# EAGLE design LaunchPadFlightController_Schematic (EAGLE 7.2.0)
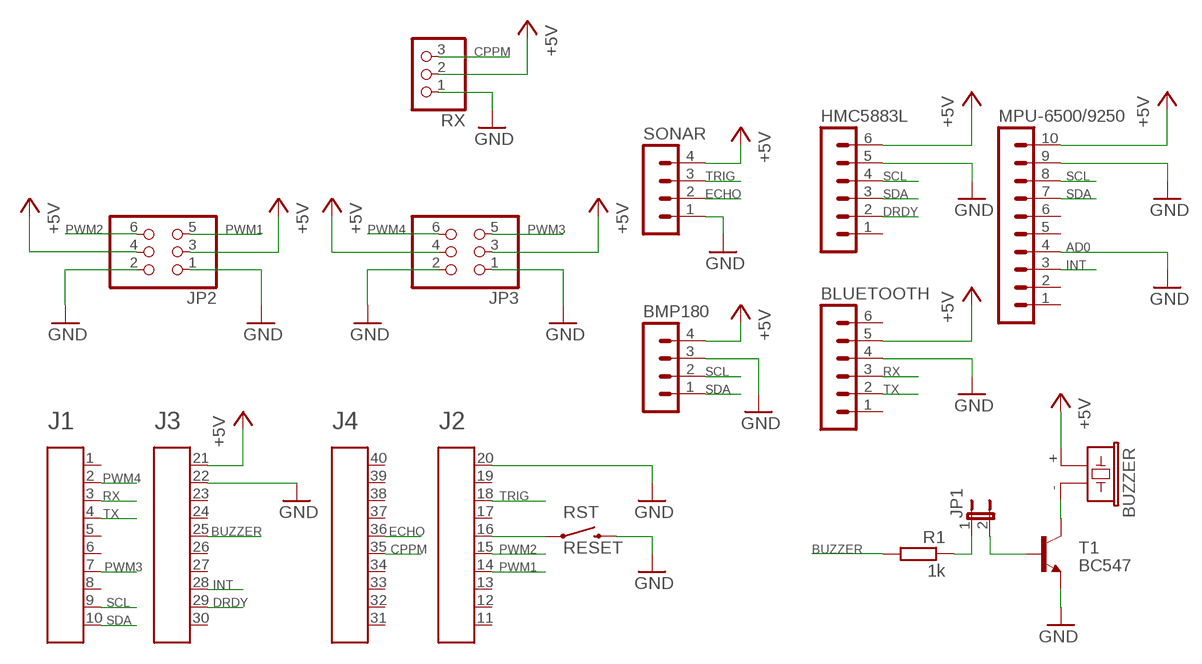
[diagram p0: schematic, sheet 1]

## Parts
A1  HEADER4X10-BOOSTERPACK  [4X10-BOOSTERPACK]
BLUETOOTH  MA06-1  [MA06-1]
BMP180  MA04-1  [MA04-1]
BUZZER  F/CM12P  [F/CM12P]
HMC5883L  MA06-1  [MA06-1]
JP1  JP1E  [JP1]
JP2  PINHD-2X3  [2X03]
JP3  PINHD-2X3  [2X03]
MPU-6500/9250  MA10-1  [MA10-1]
R1  1k  R-EU_0207/10  [0207/10]
RST  RESET  SWITCHES_PTH_EZ  [TACTILE-PTH-EZ]
RX  PINHD-1X3  [1X03]
SONAR  MA04-1  [MA04-1]
T1  BC547  [TO92]

## Nets
+5V: A1.21 BLUETOOTH.5 BMP180.4 BUZZER.+ HMC5883L.6 JP2.3 JP2.4 JP3.3 JP3.4 MPU-6500/9250.10 RX.2 SONAR.4
BUZZER: A1.25 R1.2
CPPM: A1.35 RX.3
DRDY: A1.29 HMC5883L.2
ECHO: A1.36 SONAR.2
GND: A1.20 A1.22 BLUETOOTH.4 BMP180.3 HMC5883L.5 JP2.1 JP2.2 JP3.1 JP3.2 MPU-6500/9250.4 MPU-6500/9250.9 RST.3 RX.1 SONAR.1 T1.1(E)
INT: A1.28 MPU-6500/9250.3
N$1: A1.16 RST.1
N$2: JP1.1 R1.1
N$3: JP1.2 T1.2(B)
N$4: BUZZER.- T1.3(C)
PWM1: A1.14 JP2.5
PWM2: A1.15 JP2.6
PWM3: A1.7 JP3.5
PWM4: A1.2 JP3.6
RX: A1.3 BLUETOOTH.3
SCL: A1.9 BMP180.2 HMC5883L.4 MPU-6500/9250.8
SDA: A1.10 BMP180.1 HMC5883L.3 MPU-6500/9250.7
TRIG: A1.18 SONAR.3
TX: A1.4 BLUETOOTH.2
Unconnected: A1.1 A1.5 A1.6 A1.8 A1.11 A1.12 A1.13 A1.17 A1.19 A1.23 A1.24 A1.26 A1.27 A1.30 A1.31 A1.32 A1.33 A1.34 A1.37 A1.38 A1.39 A1.40 BLUETOOTH.1 BLUETOOTH.6 HMC5883L.1 MPU-6500/9250.1 MPU-6500/9250.2 MPU-6500/9250.5 MPU-6500/9250.6

## Notes on the sheet
- AD0

## Library data of the parts
A1 = EAGLE_BoosterPack_Library:HEADER4X10-BOOSTERPACK
BLUETOOTH HMC5883L = con-lstb:MA06-1: PIN HEADER; OC_FARNELL: unknown; OC_NEWARK: unknown
BMP180 SONAR = con-lstb:MA04-1: PIN HEADER; OC_FARNELL: unknown; OC_NEWARK: unknown
BUZZER = buzzer:F/CM12P: BUZZER Source: Buerklin; OC_FARNELL: unknown; OC_NEWARK: unknown
JP1 = jumper:JP1E: JUMPER
JP2 JP3 = pinhead:PINHD-2X3: PIN HEADER
MPU-6500/9250 = con-lstb:MA10-1: PIN HEADER; OC_FARNELL: unknown; OC_NEWARK: unknown
R1 = rcl:R-EU_: RESISTOR, European symbol
RST = EAGLE_BoosterPack_Library:SWITCHES_: Various NO switches- pushbuttons, reed, etc
RX = pinhead:PINHD-1X3: PIN HEADER
T1 = transistor:BC547: NPN TRANSISTOR

## Board
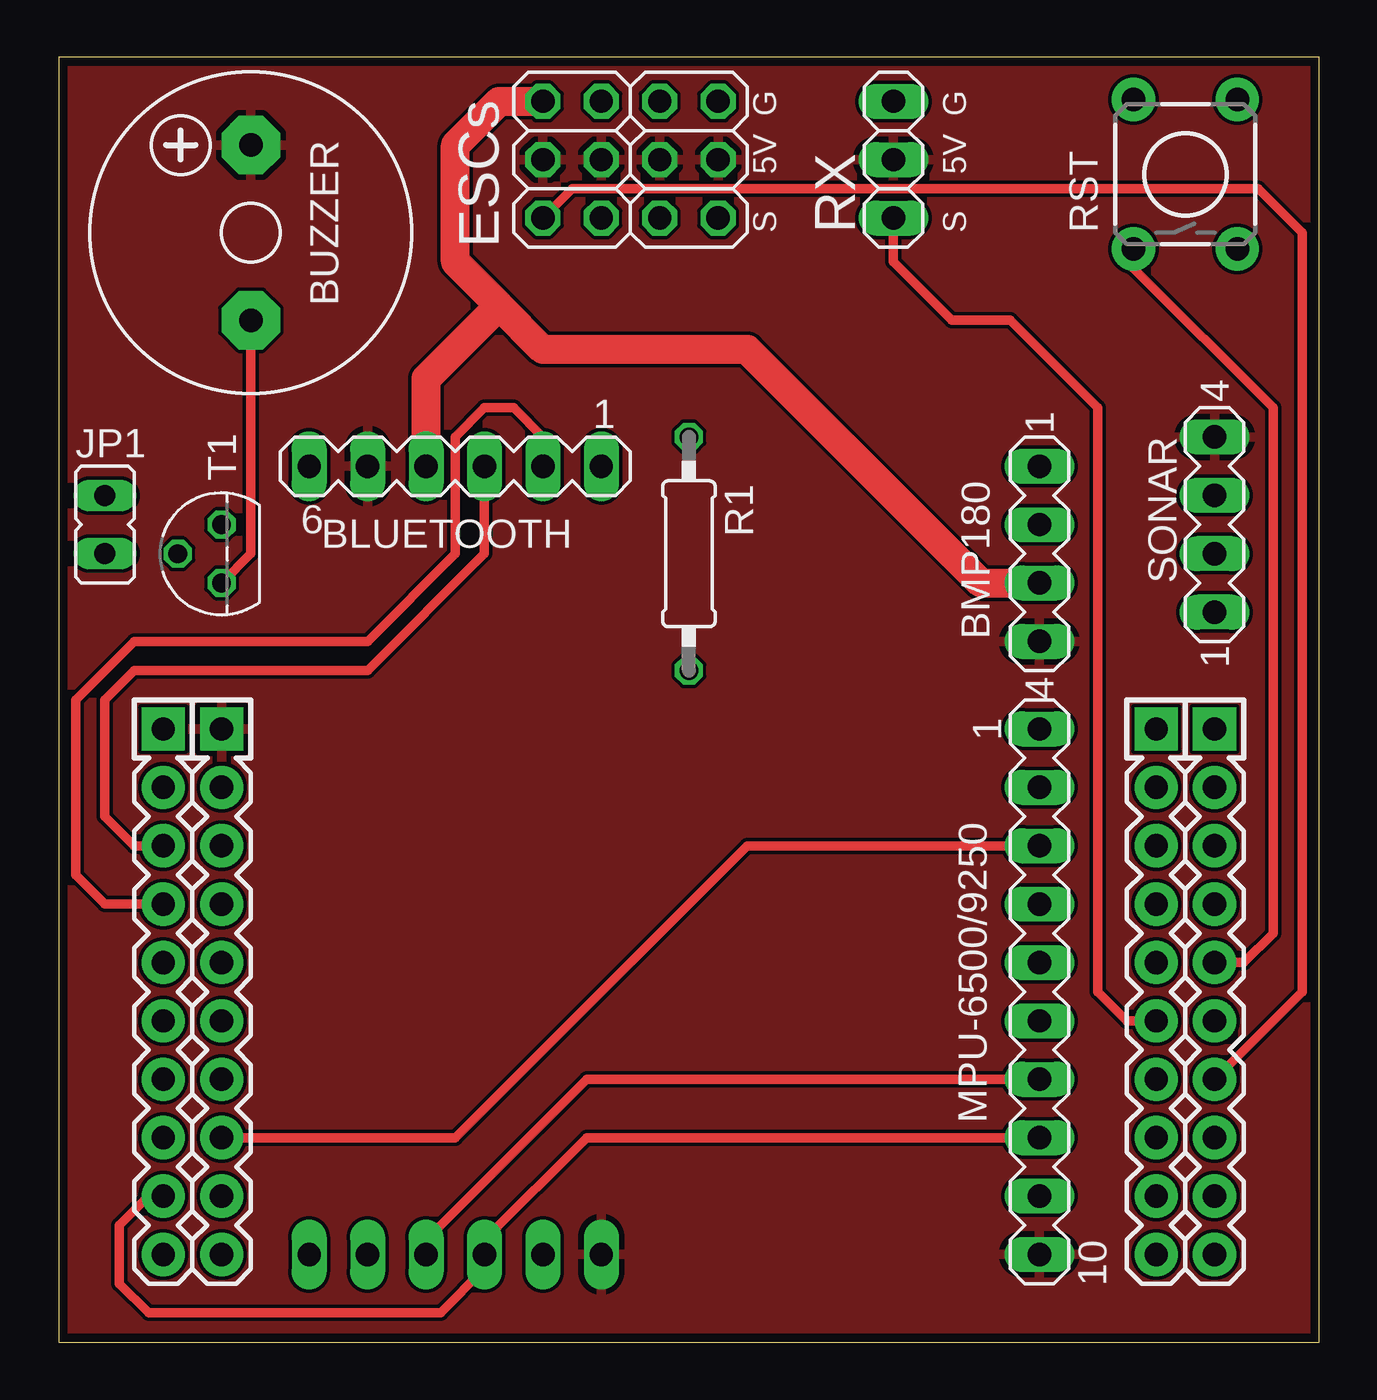
[diagram p1: board, top side]
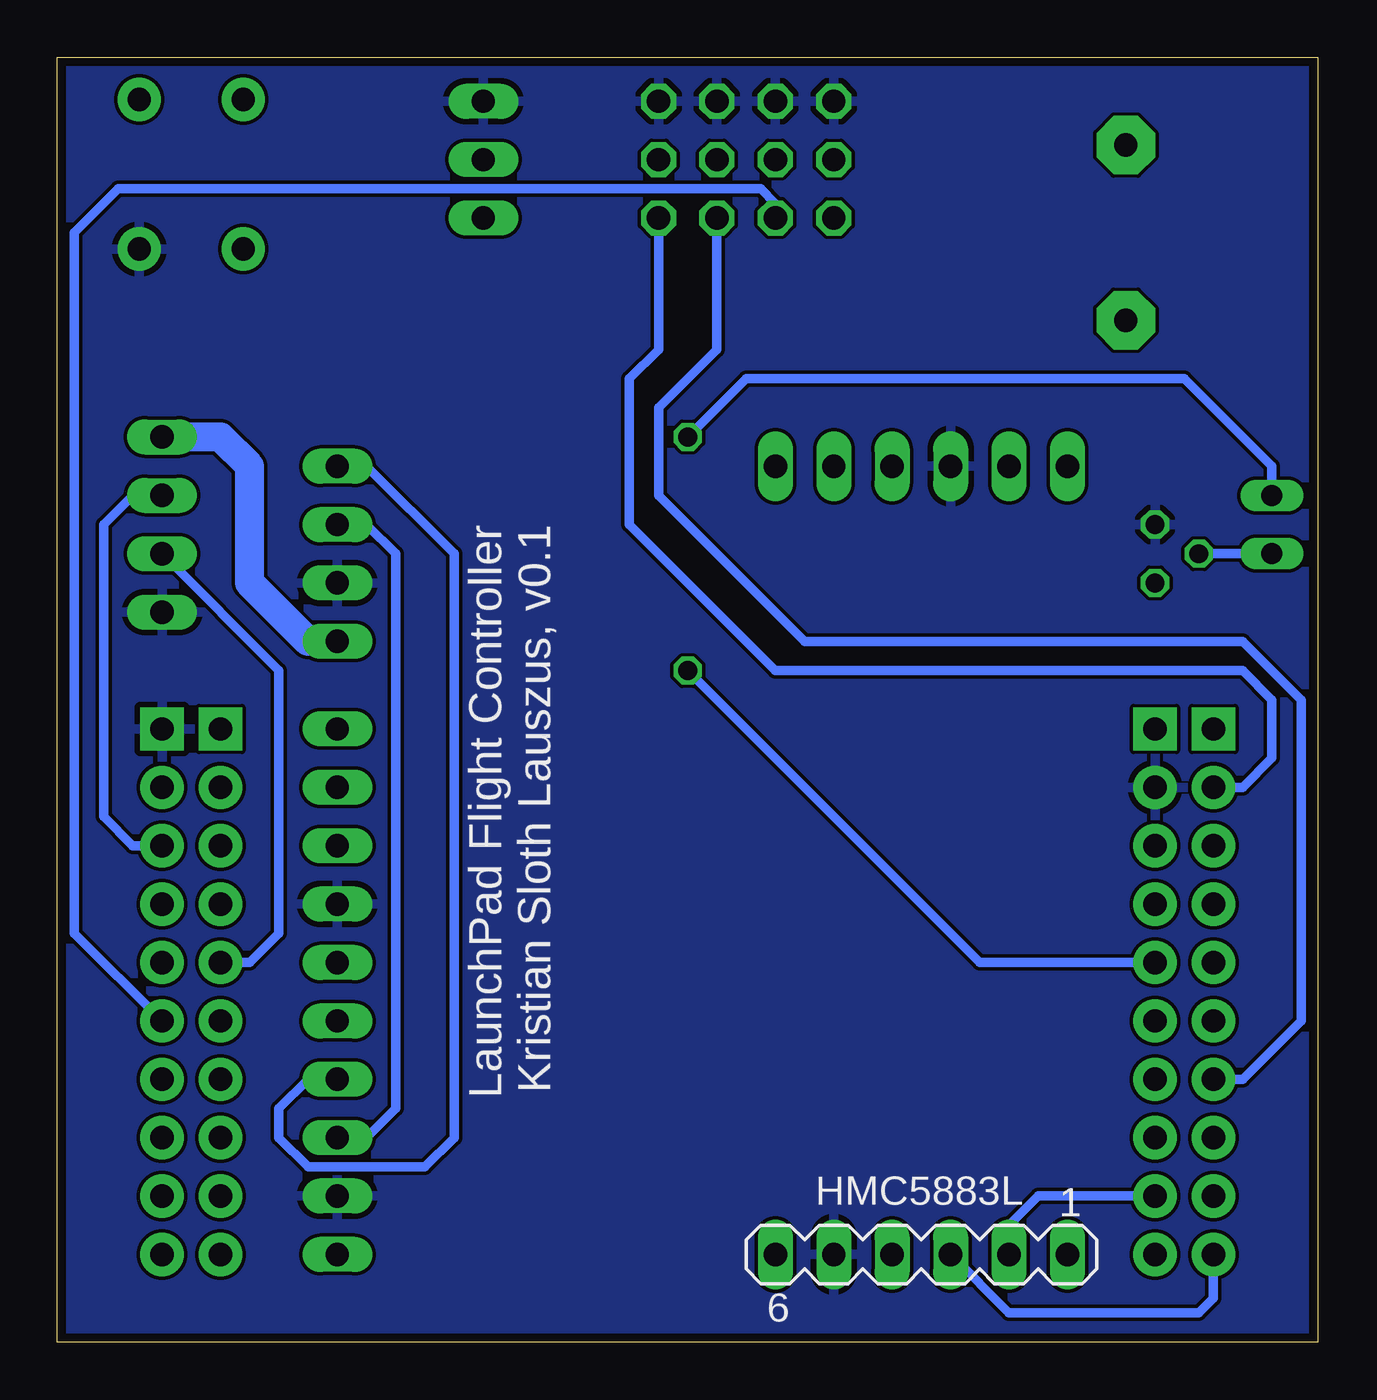
[diagram p2: board, bottom side, seen from below]

Size 54.81 x 55.88 mm. Coordinates in mm from the lower left corner, seen from the top.
Outline: 0,0 54.81,0 54.81,55.88 0,55.88 0,0
Copper layers (1*16): Top 0.0356mm / dielectric 1.5011mm / Bottom 0.0356mm
Design rules "LaenPCBOrder": minimum track width 6mil, minimum drill 13mil, track to track 6mil, track to pad 6mil, pad to pad 6mil, via to via 6mil, smd to smd 6mil, copper to edge 15mil, drill to drill 6mil, minimum pad ring 7mil, minimum via ring 7mil, stop-mask expansion 3mil, vias tented up to drill 0mil, thermal gap 10mil

### Footprints (pad centres in the part's own frame; a part is rotated, then mirrored left to right if it is on the bottom)
4X10-BOOSTERPACK = drill 1.016 pad 1.88 square: 1 0,10.16; 20 45.72,10.16; 21 2.54,10.16; 40 43.18,10.16 | drill 1.016 pad 1.88: 2 0,7.62; 3 0,5.08; 4 0,2.54; 5 0,0; 6 0,-2.54; 7 0,-5.08; 8 0,-7.62; 9 0,-10.16; 10 0,-12.7; 11 45.72,-12.7; 12 45.72,-10.16; 13 45.72,-7.62; 14 45.72,-5.08; 15 45.72,-2.54; 16 45.72,0; 17 45.72,2.54; 18 45.72,5.08; 19 45.72,7.62; 22 2.54,7.62; 23 2.54,5.08; 24 2.54,2.54; 25 2.54,0; 26 2.54,-2.54; 27 2.54,-5.08; 28 2.54,-7.62; 29 2.54,-10.16; 30 2.54,-12.7; 31 43.18,-12.7; 32 43.18,-10.16; 33 43.18,-7.62; 34 43.18,-5.08; 35 43.18,-2.54; 36 43.18,0; 37 43.18,2.54; 38 43.18,5.08; 39 43.18,7.62
MA06-1 = drill 1.016 long: 1 -6.35,0; 2 -3.81,0; 3 -1.27,0; 4 1.27,0; 5 3.81,0; 6 6.35,0
MA04-1 = drill 1.016 long: 1 -3.81,0; 2 -1.27,0; 3 1.27,0; 4 3.81,0
F/CM12P = drill 1.016 pad 2.54 octagon: + 3.81,0; - -3.81,0
JP1 = drill 0.914 long: 1 0,-1.27; 2 0,1.27
2X03 = drill 1.016 octagon: 1 -2.54,-1.27; 2 -2.54,1.27; 3 0,-1.27; 4 0,1.27; 5 2.54,-1.27; 6 2.54,1.27
MA10-1 = drill 1.016 long: 1 -11.43,0; 2 -8.89,0; 3 -6.35,0; 4 -3.81,0; 5 -1.27,0; 6 1.27,0; 7 3.81,0; 8 6.35,0; 9 8.89,0; 10 11.43,0
0207/10 = drill 0.813 octagon: 1 -5.08,0; 2 5.08,0
TACTILE-PTH-EZ = drill 1.016 pad 1.88: 1 -3.251,2.261; 2 3.251,2.261; 3 -3.251,-2.261; 4 3.251,-2.261
1X03 = drill 1.016 long: 1 -2.54,0; 2 0,0; 3 2.54,0
TO92 = drill 0.813 octagon: 1 1.27,0; 2 0,1.905; 3 -1.27,0

### Placement (x,y rotation side)
A1  4.55,16.51 0 top
BLUETOOTH  17.25,38.1 180 top
BMP180  42.65,34.29 270 top
BUZZER  8.36,48.26 90 top
HMC5883L  17.25,3.81 180 bottom
JP1  2.01,35.56 180 top
JP2  22.33,51.44 270 top
JP3  27.41,51.44 270 top
MPU-6500/9250  42.65,15.24 270 top
R1  27.41,34.29 270 top
RST  49,50.8 90 top
RX  36.3,51.44 270 top
SONAR  50.27,35.56 90 top
T1  7.09,34.29 90 top

### Tracks (layer width: path | path; a pad name or v marks a point on that pad's centre or on a via)
+5V
  Bottom 1.27: BMP180.4 43.92,30.48 46.46,33.02 46.46,38.1 47.73,39.37 SONAR.4
  pour Top: -2.44,58.42 59.79,59.69 59.79,-2.54 -2.44,-2.54
BUZZER
  Bottom 0.406: R1.2 14.71,16.51 A1.25
CPPM
  Top 0.406: A1.35 46.46,13.97 45.19,15.24 45.19,40.64 41.38,44.45 38.84,44.45 36.3,46.99 RX.3
DRDY
  Bottom 0.406: A1.29 12.17,6.35 13.44,5.08 HMC5883L.2
ECHO
  Bottom 0.406: SONAR.2 45.19,29.21 45.19,17.78 46.46,16.51 A1.36
GND
  Top 1.27: BMP180.3 40.11,33.02 29.95,43.18 21.06,43.18 19.15,45.09 | 19.15,45.09 17.25,46.99 17.25,52.07 19.15,53.98 JP2.1 | BLUETOOTH.4 15.98,41.91 19.15,45.09
  pour Bottom: -3.71,60.96 59.79,59.69 59.79,-2.54 -2.44,-2.54
INT
  Top 0.406: MPU-6500/9250.3 29.95,21.59 17.25,8.89 A1.28
N$1
  Top 0.406: A1.16 51.54,16.51 52.81,17.78 52.81,40.64 46.74,46.71 RST.1
N$2
  Bottom 0.406: R1.1 24.87,41.91 5.82,41.91 2.01,38.1 JP1.1
N$3
  Bottom 0.406: JP1.2 T1.2
N$4
  Top 0.406: BUZZER.- 8.36,34.29 T1.3
PWM1
  Top 0.406: A1.14 54.08,15.24 54.08,48.26 52.17,50.16 22.33,50.16 JP2.5
PWM2
  Bottom 0.406: JP2.6 23.6,49.53 24.23,50.16 52.17,50.16 54.08,48.26 54.08,17.78 A1.15
PWM3
  Bottom 0.406: A1.7 3.28,11.43 0.74,13.97 0.74,27.94 3.28,30.48 22.33,30.48 28.68,36.83 28.68,40.64 26.14,43.18 JP3.5
PWM4
  Bottom 0.406: A1.2 3.28,24.13 2.01,25.4 2.01,27.94 3.28,29.21 23.6,29.21 29.95,35.56 29.95,41.91 28.68,43.18 JP3.6
RX
  Top 0.406: A1.3 3.28,21.59 2.01,22.86 2.01,27.94 3.28,29.21 13.44,29.21 18.52,34.29 BLUETOOTH.3
SCL
  Top 0.406: A1.9 3.91,6.35 2.64,5.08 2.64,2.54 3.91,1.27 16.61,1.27 18.52,3.17 HMC5883L.4 18.52,4.45 22.96,8.89 MPU-6500/9250.8
  Bottom 0.406: MPU-6500/9250.8 41.38,8.89 40.11,10.16 40.11,34.29 41.38,35.56 BMP180.2
SDA
  Top 0.406: HMC5883L.3 15.98,4.45 22.96,11.43 MPU-6500/9250.7
  Bottom 0.406: BMP180.1 41.38,38.1 37.57,34.29 37.57,8.89 38.84,7.62 43.92,7.62 45.19,8.89 45.19,10.16 43.92,11.43 MPU-6500/9250.7 | A1.10 4.55,1.91 5.18,1.27 13.44,1.27 HMC5883L.3
TRIG
  Bottom 0.406: SONAR.3 51.54,36.83 52.81,35.56 52.81,22.86 51.54,21.59 A1.18
TX
  Top 0.406: A1.4 2.01,19.05 0.74,20.32 0.74,27.94 3.28,30.48 13.44,30.48 17.25,34.29 17.25,39.37 18.52,40.64 19.79,40.64 21.06,39.37 BLUETOOTH.2

### Text on the board
tNames: G | G | 5V | 5V | ESCs | S | S
bNames: LaunchPad Flight Controller / Kristian Sloth Lauszus, v0.1